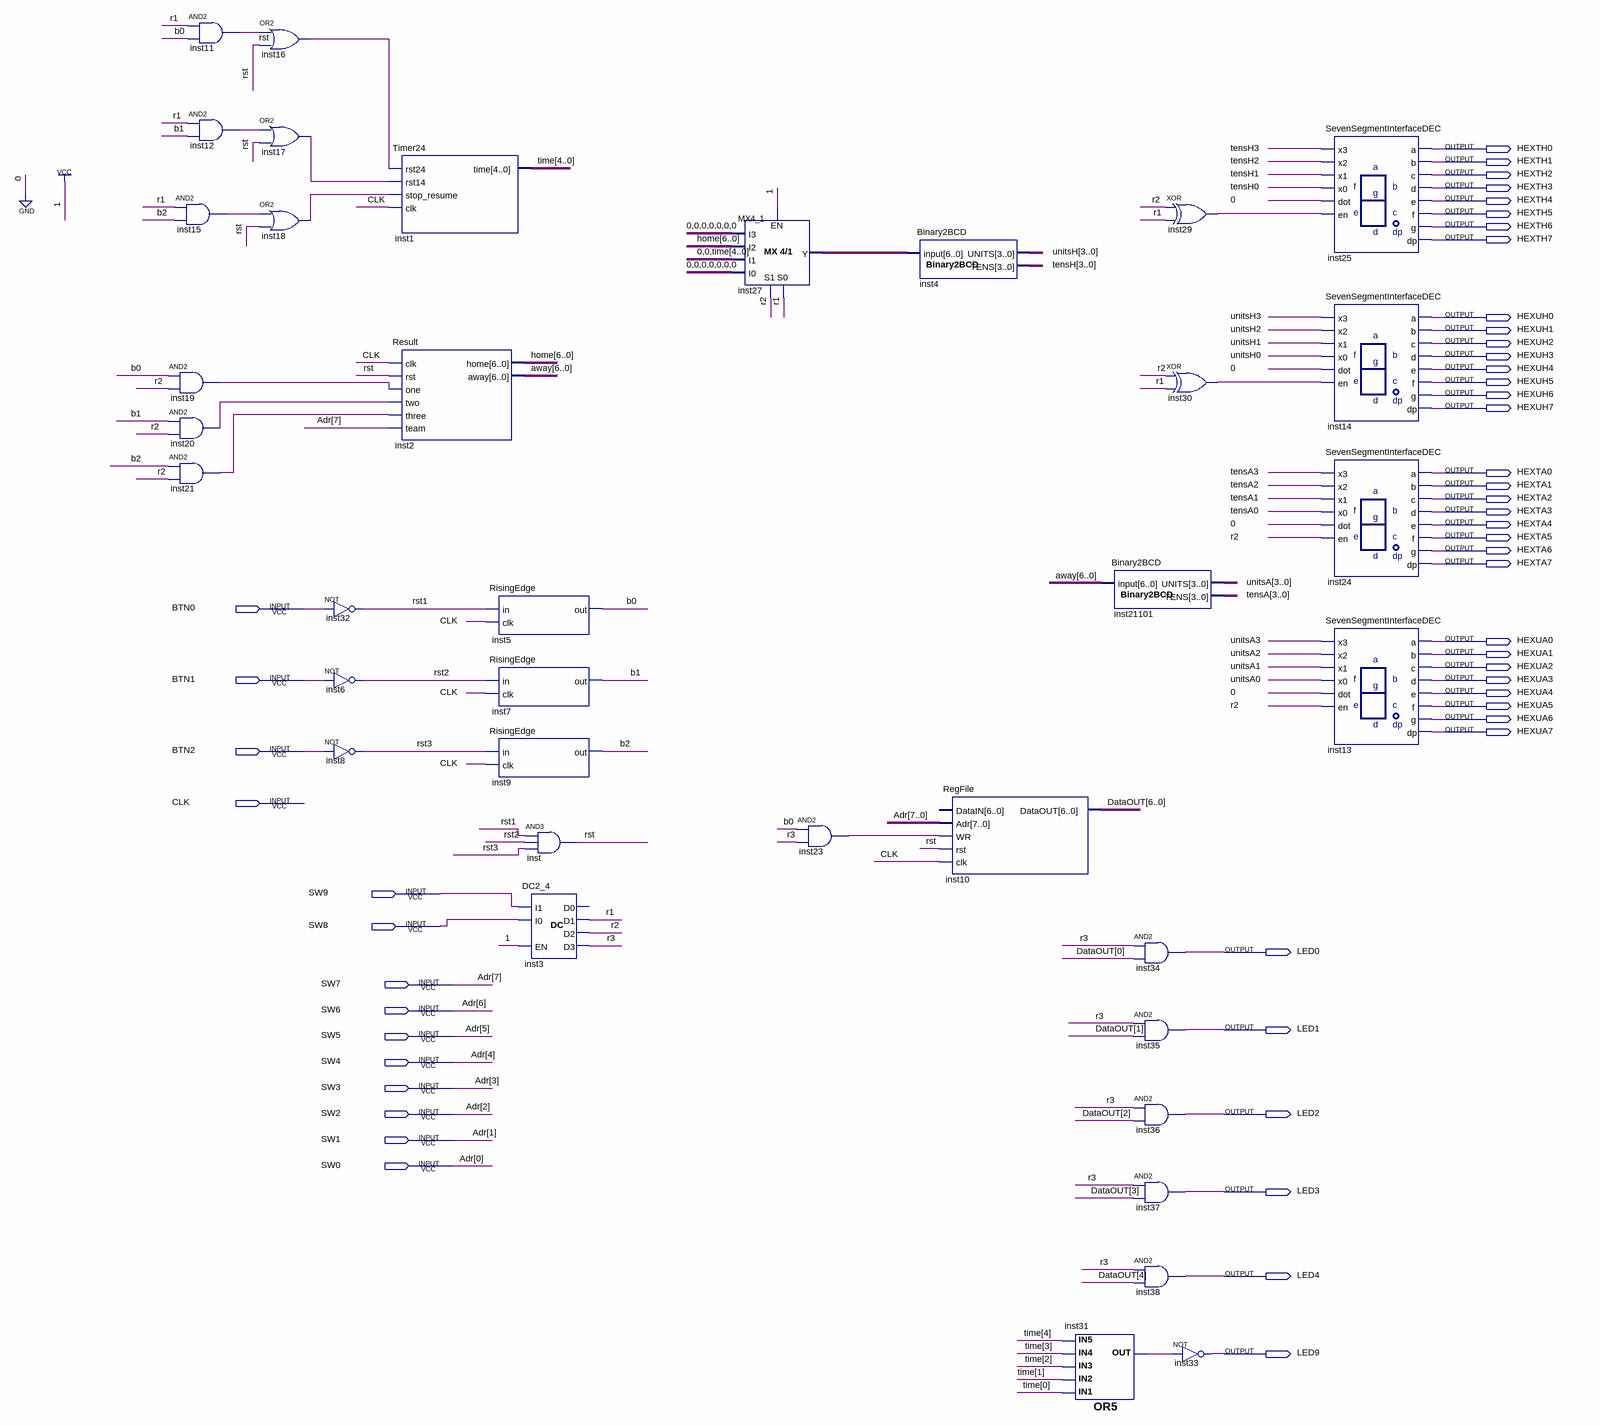
[diagram p0: schematic sheet]
// Quartus schematic Lab.bdf as structural Verilog: 37 symbols, 52 pins
module Lab (
  input  BTN0,
  input  BTN1,
  input  BTN2,
  input  CLK,
  input  SW9,
  input  SW8,
  input  SW7,
  input  SW6,
  input  SW5,
  input  SW4,
  input  SW3,
  input  SW2,
  input  SW1,
  input  SW0,
  output HEXTH0,
  output HEXTH1,
  output HEXTH2,
  output HEXTH3,
  output HEXTH4,
  output HEXTH5,
  output HEXTH6,
  output HEXTH7,
  output HEXUH0,
  output HEXUH1,
  output HEXUH2,
  output HEXUH3,
  output HEXUH4,
  output HEXUH5,
  output HEXUH6,
  output HEXUH7,
  output HEXTA0,
  output HEXTA1,
  output HEXTA2,
  output HEXTA3,
  output HEXTA4,
  output HEXTA5,
  output HEXTA6,
  output HEXTA7,
  output HEXUA0,
  output HEXUA1,
  output HEXUA2,
  output HEXUA3,
  output HEXUA4,
  output HEXUA5,
  output HEXUA6,
  output HEXUA7,
  output LED0,
  output LED1,
  output LED2,
  output LED3,
  output LED4,
  output LED9
);

  wire b0, b1, b2, inst11_out, inst12_out, inst15_out, inst16_out, inst17_out, inst18_out, inst19_out,
       inst20_out, inst21_out, inst23_out, inst29_out, inst30_out, inst31_out, r1, r2, r3, rst, rst1, rst2,
       rst3;
  wire [3:0] tensA, tensH, unitsA, unitsH;
  wire [4:0] \time ;
  wire [6:0] away, DataOUT, home, inst27_y;

  and inst11 (inst11_out, r1, b0);
  and inst12 (inst12_out, r1, b1);
  and inst15 (inst15_out, r1, b2);
  and inst19 (inst19_out, b0, r2);
  and inst20 (inst20_out, b1, r2);
  and inst21 (inst21_out, b2, r2);
  or inst16 (inst16_out, inst11_out, rst);
  or inst17 (inst17_out, inst12_out, rst);
  or inst18 (inst18_out, inst15_out, rst);
  not inst32 (rst1, BTN0);
  not inst6 (rst2, BTN1);
  not inst8 (rst3, BTN2);
  Timer24 inst1 (.rst24(inst16_out), .rst14(inst17_out), .stop_resume(inst18_out), .clk(CLK), .\time (\time ));
  Result inst2 (
    .clk(CLK), .rst(rst), .one(inst19_out), .two(inst20_out), .three(inst21_out), .team(SW7), .home(home),
    .away(away));
  RisingEdge inst5 (.clk(CLK), .\input (rst1), .\output (b0));
  RisingEdge inst7 (.clk(CLK), .\input (rst2), .\output (b1));
  RisingEdge inst9 (.clk(CLK), .\input (rst3), .\output (b2));
  DC2_4 inst3 (.I0(SW8), .I1(SW9), .EN(1'b1), .D1(r1), .D2(r2), .D3(r3));  // open: D0
  and inst (rst, rst1, rst2, rst3);
  MX4_1 inst27 (
    .S1(r2), .S0(r1), .EN(1'b1), .I3({7{1'b0}}), .I2(home), .I1({2'b00, \time }), .I0({7{1'b0}}), .Y(inst27_y));
  and inst23 (inst23_out, b0, r3);
  Binary2BCD inst4 (.binary_input(inst27_y), .bcd_units(unitsH), .bcd_tens(tensH));
  RegFile inst10 (
    .Adr({SW7, SW6, SW5, SW4, SW3, SW2, SW1, SW0}), .WR(inst23_out), .rst(rst), .clk(CLK), .DataOUT(DataOUT));  // open: DataIN
  or inst31 (inst31_out, \time [0], \time [1], \time [2], \time [3], \time [4]);
  Binary2BCD inst21101 (.binary_input(away), .bcd_units(unitsA), .bcd_tens(tensA));
  and inst34 (LED0, r3, DataOUT[0]);
  and inst35 (LED1, r3, DataOUT[1]);
  and inst36 (LED2, r3, DataOUT[2]);
  and inst37 (LED3, r3, DataOUT[3]);
  and inst38 (LED4, r3, DataOUT[4]);
  xor inst29 (inst29_out, r2, r1);
  xor inst30 (inst30_out, r2, r1);
  not inst33 (LED9, inst31_out);
  SevenSegmentInterfaceDEC inst25 (
    .x3(tensH[3]), .x2(tensH[2]), .x1(tensH[1]), .x0(tensH[0]), .dot(1'b0), .en(inst29_out), .a(HEXTH0),
    .b(HEXTH1), .c(HEXTH2), .d(HEXTH3), .e(HEXTH4), .f(HEXTH5), .g(HEXTH6), .dp(HEXTH7));
  SevenSegmentInterfaceDEC inst14 (
    .x3(unitsH[3]), .x2(unitsH[2]), .x1(unitsH[1]), .x0(unitsH[0]), .dot(1'b0), .en(inst30_out), .a(HEXUH0),
    .b(HEXUH1), .c(HEXUH2), .d(HEXUH3), .e(HEXUH4), .f(HEXUH5), .g(HEXUH6), .dp(HEXUH7));
  SevenSegmentInterfaceDEC inst24 (
    .x3(tensA[3]), .x2(tensA[2]), .x1(tensA[1]), .x0(tensA[0]), .dot(1'b0), .en(r2), .a(HEXTA0), .b(HEXTA1),
    .c(HEXTA2), .d(HEXTA3), .e(HEXTA4), .f(HEXTA5), .g(HEXTA6), .dp(HEXTA7));
  SevenSegmentInterfaceDEC inst13 (
    .x3(unitsA[3]), .x2(unitsA[2]), .x1(unitsA[1]), .x0(unitsA[0]), .dot(1'b0), .en(r2), .a(HEXUA0),
    .b(HEXUA1), .c(HEXUA2), .d(HEXUA3), .e(HEXUA4), .f(HEXUA5), .g(HEXUA6), .dp(HEXUA7));

  // Other names for the same wires on the sheet: Adr[7:0] = {SW7, SW6, SW5, SW4, SW3, SW2, SW1, SW0}
endmodule
